# Altium schematic sheet Power_Block.SchDoc
size A4; SheetNumber: 2; SheetTotal: 9
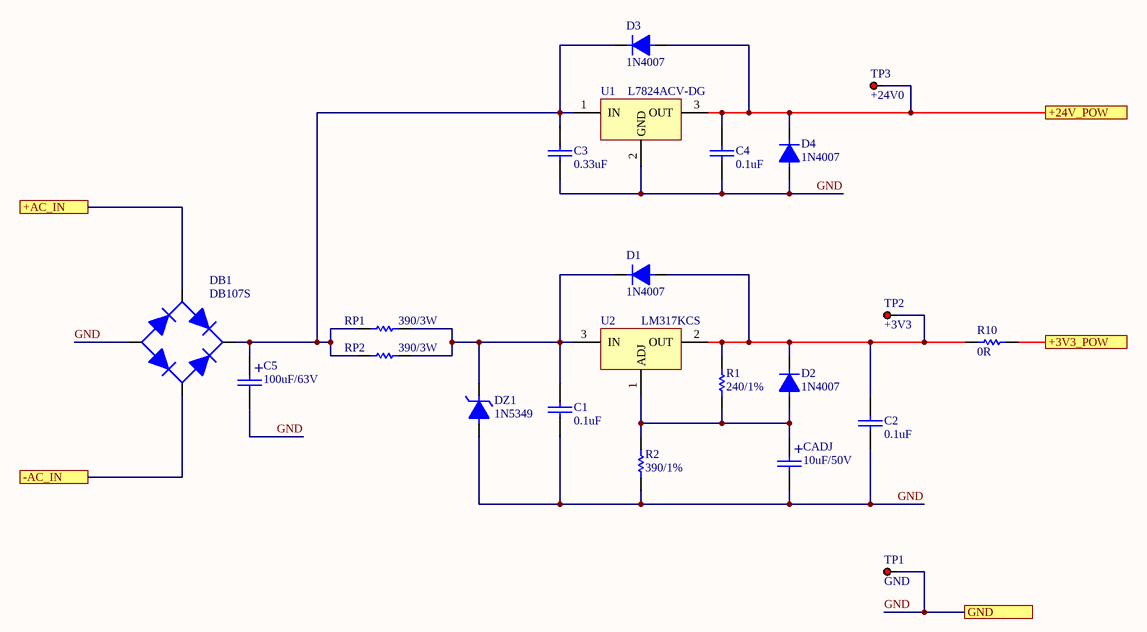
[diagram p0: Power_Block.SchDoc]

## Parts
C1  0.1uF  [1206-CAP-TDK]
C2  0.1uF  [1206-CAP-TDK]
C3  0.33uF  [CAP200]
C4  0.1uF  [1206-CAP-TDK]
C5  100uF/63V  [CAP200RP]
CADJ  10uF/50V  [CAP100RP]
D1  1N4007  [DO41]
D2  1N4007  [DO41]
D3  1N4007  [DO41]
D4  1N4007  [DO41]
DB1  DB107S  [DBS]
DZ1  1N5349  [DO40]
R1  240/1%  [RES400]
R2  390/1%  [RES400]
R10  0R  [1206-RES-PANASONIC]
RP1  390/3W  [RES1000 - NOSILK]
RP2  390/3W  [RES1000 - NOSILK]
TP1  GND  [TPTH - PAD TOP]  (no BOM)
TP2  +3V3  [TPTH - PAD TOP]  (no BOM)
TP3  +24V0  [TPTH - PAD TOP]  (no BOM)
U1  L7824ACV-DG  [TO-220 - DG - RA]
U2  LM317KCS  [TO-220 - KCS0003B - RA]

## Ports
+3V3_POW, +24V_POW, +AC_IN, -AC_IN, GND

## Nets
+3V3_POW: R10.2 ; port +3V3_POW
+24V_POW: C4.2 D3.1 D4.2 TP3.1 U1.3(OUT) ; port +24V_POW
+AC_IN: DB1.1(AC+) ; port +AC_IN
-AC_IN: DB1.3(AC-) ; port -AC_IN
GND: C1.1 C2.1 C3.1 C4.1 C5.2 CADJ.2 D4.1 DB1.4(-) DZ1.1 R2.1 TP1.1 U1.2(GND) ; port GND
NetC1_2: C1.2 D1.2 DZ1.2 RP1.2 RP2.2 U2.3(IN)
NetC2_2: C2.2 D1.1 D2.2 R1.2 R10.1 TP2.1 U2.2(OUT)
NetC3_2: C3.2 C5.1 D3.2 DB1.2(+) RP1.1 RP2.1 U1.1(IN)
NetCADJ_1: CADJ.1 D2.1 R1.1 R2.2 U2.1(ADJ)

## Notes on the sheet
- (in symbol CAPPOL-THT) +

## Library data of the parts
C1 C2 C4 = CAP-SMD: JLCPart: C24497
C3 = CAP-THT: JLCPart: C2761750
C5 CADJ = CAPPOL-THT
  C5: JLCPart: C165651
  CADJ: JLCPart: C2960372
D1-D4 = DIODE RECTIFIER: JLCPart: C3033995
DB1 = DB107S: Bridge Rectifier Single Phase Standard 1000 V Surface Mount 4-MiniDIP; JLCPart: C5377
DZ1 = DIODE ZENER: JLCPart: C232446
R1 R2 RP1 RP2 = RES-THT
  R1: JLCPart: C119310
  R2: JLCPart: C119315
  RP1 RP2: JLCPart: C348872
R10 = RES-SMD
TP1-TP3 = TP-PAD